# EAGLE design ESP32botV1 (EAGLE 7.7.0)
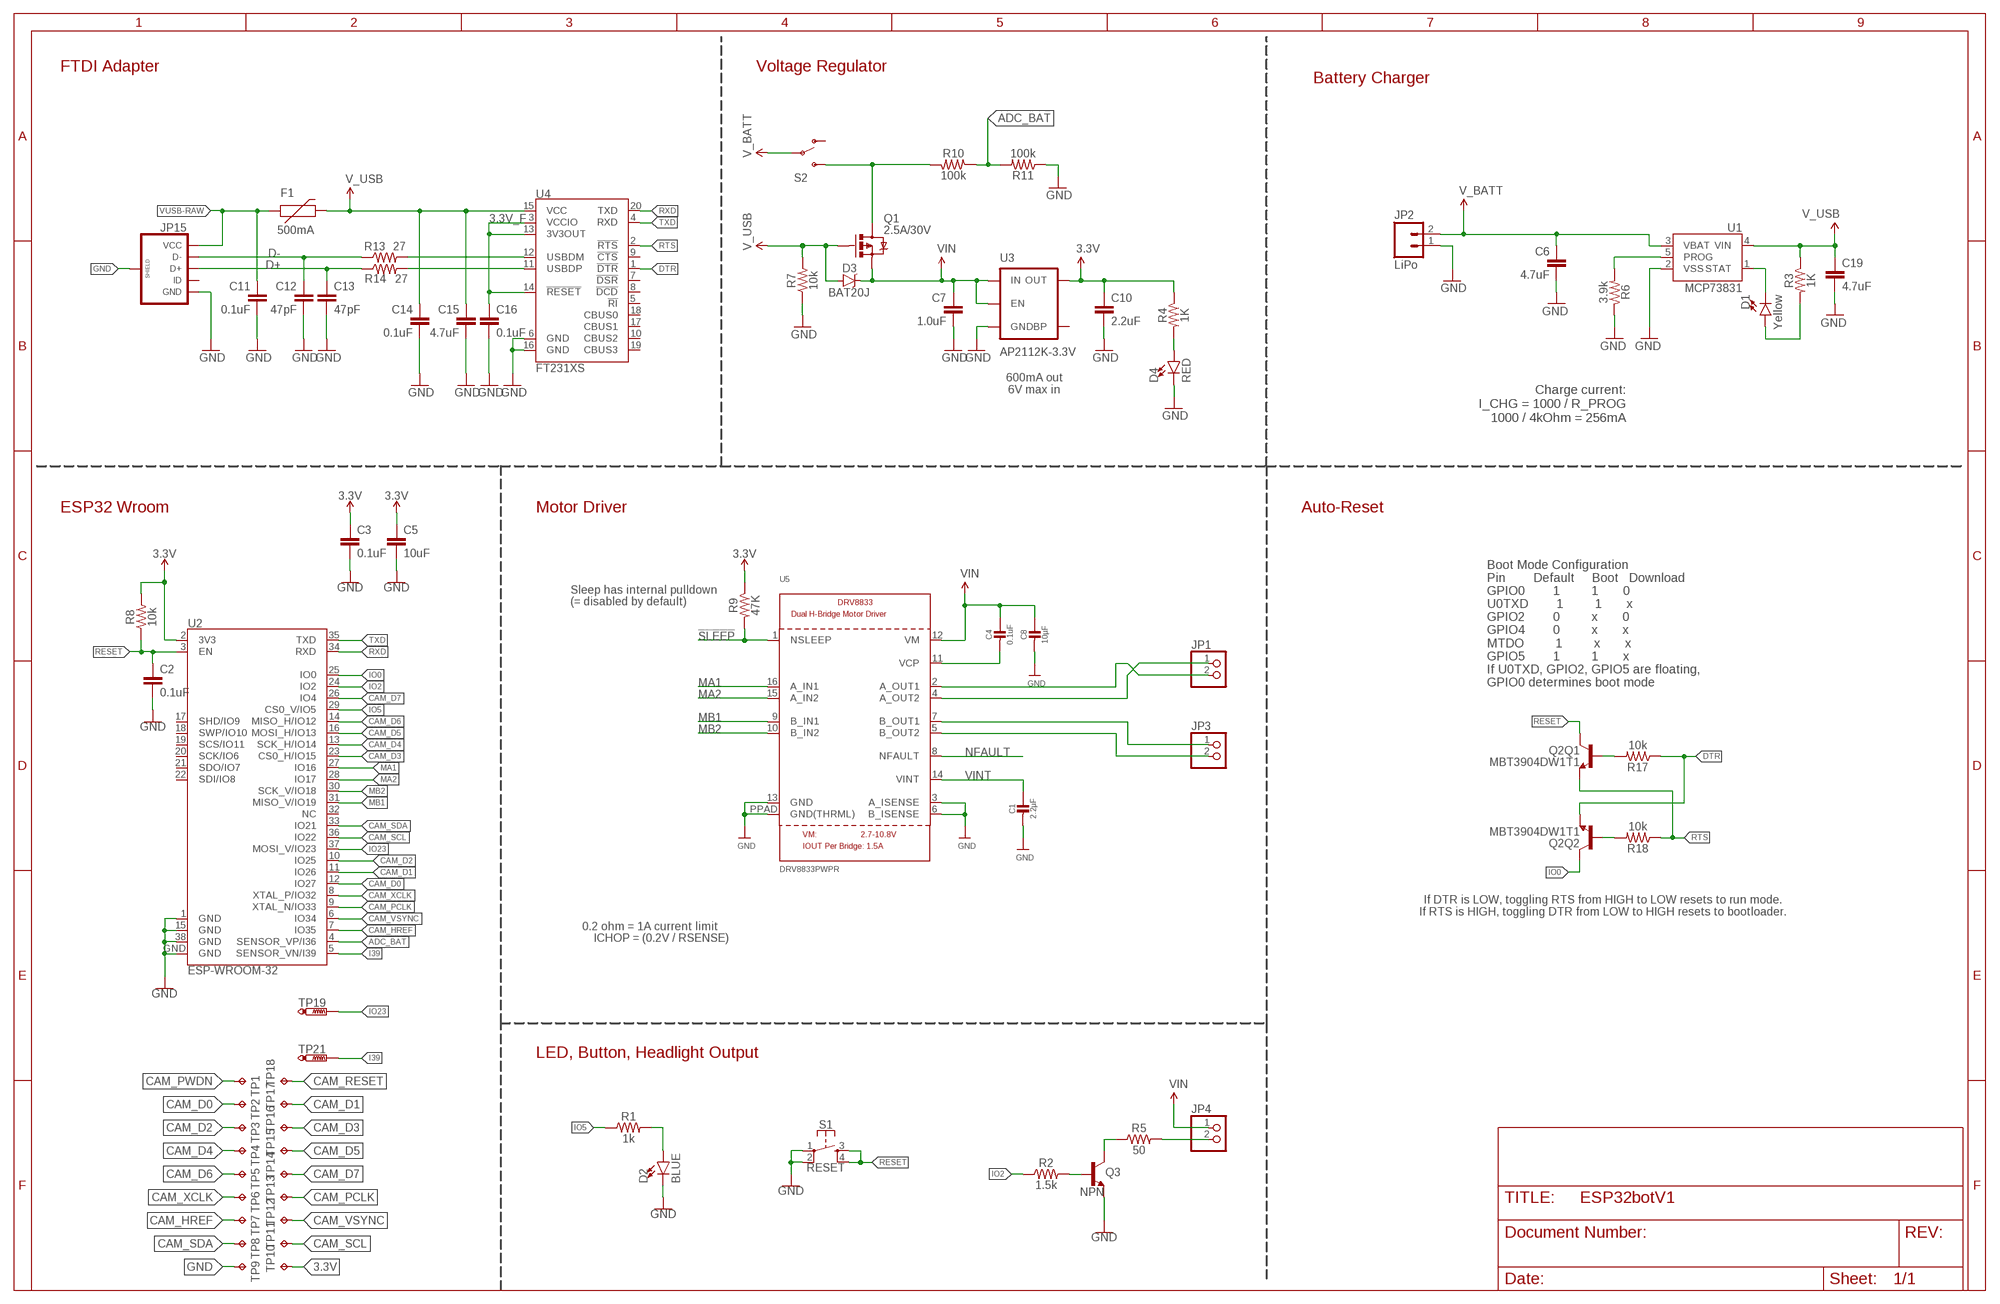
[diagram p0: schematic, sheet 1]

## Parts
C1  2.2µF  CAP_CERAMIC0805-NOOUTLINE  [0805-NO]
C2  0.1uF  0.1UF-0603-25V-(+80/-20%)  [0603]
C3  0.1uF  0.1UF-0603-25V-(+80/-20%)  [0603]
C4  0.1uF  CAP_CERAMIC0805-NOOUTLINE  [0805-NO]
C5  10uF  10UF-0603-6.3V-20%  [0603]
C6  4.7uF  4.7UF0603  [0603]
C7  1.0uF  1.0UF-0805-25V-(+80/-20%)  [0805]
C8  10µF  CAP_CERAMIC0805-NOOUTLINE  [0805-NO]
C10  2.2uF  2.2UF-0603-10V-20%  [0603]
C11  0.1uF  0.1UF-0603-25V-(+80/-20%)  [0603]
C12  47pF  47PF-0603-50V-5%  [0603]
C13  47pF  47PF-0603-50V-5%  [0603]
C14  0.1uF  0.1UF-0603-25V-(+80/-20%)  [0603]
C15  4.7uF  4.7UF-6.3V-10%(0603)0603  [0603-CAP]
C16  0.1uF  0.1UF-0603-25V-(+80/-20%)  [0603]
C19  4.7uF  4.7UF0603  [0603]
D1  Yellow  LED-YELLOW0603  [LED-0603@1]
D2  BLUE  LED-BLUE0603  [LED-0603@2]
D3  BAT20J  DIODE-SCHOTTKY-BAT20J  [SOD-323]
D4  RED  LED-RED0603  [LED-0603]
F1  500mA  PTCSMD  [PTC-1206]
JP1  HEADER-1X2ROUND  [1X02_ROUND]
JP2  LiPo  M02JST-PTH-2  [JST-2-PTH]
JP3  HEADER-1X2ROUND  [1X02_ROUND]
JP4  HEADER-1X2ROUND  [1X02_ROUND]
JP15  USB_MICROB_PLUGCONN-11752  [USB-B-MICRO-SMD_V03]
Q1  2.5A/30V  MOSFET-PCHANNELDMG2307L  [SOT23-3]
Q2  MBT3904DW1T1  [SC70-6]
Q3  NPN  TRANSISTOR_NPNMMBT2222A  [SOT23-3]
R1  1k  1KOHM-0603-1/10W-1%  [0603]
R2  1.5k  1KOHM-0603-1/10W-1%  [0603]
R3  1K  1KOHM-1/10W-1%(0603)  [0603]
R4  1K  1KOHM-1/10W-1%(0603)  [0603]
R5  50  1KOHM-0603-1/10W-1%  [0603]
R6  3.9k  2.0KOHM1/10W5%(0603)  [0603]
R7  10k  10KOHM-0603-1/10W-1%  [0603]
R8  10k  10KOHM-0603-1/10W-1%  [0603]
R9  47K  1KOHM-1/10W-1%(0603)  [0603]
R10  100k  10KOHM-0603-1/10W-1%  [0603]
R11  100k  10KOHM-0603-1/10W-1%  [0603]
R13  27  27OHM1/10W1%(0603)0603-RES  [0603]
R14  27  27OHM1/10W1%(0603)0603-RES  [0603]
R17  10k  10KOHM-0603-1/10W-1%  [0603]
R18  10k  10KOHM-0603-1/10W-1%  [0603]
S1  RESET  MOMENTARY-SWITCH-SPST-2-SMD-4.6X2.8MM  [TACTILE_SWITCH_SMD_4.6X2.8MM]
S2  SWITCH-SPDT-SMD-A  [SWITCH-SPST-SMD-A]
TP1  TPEC  [EDGECONNECTOR]
TP2  TPEC  [EDGECONNECTOR]
TP3  TPEC  [EDGECONNECTOR]
TP4  TPEC  [EDGECONNECTOR]
TP5  TPEC  [EDGECONNECTOR]
TP6  TPEC  [EDGECONNECTOR]
TP7  TPEC  [EDGECONNECTOR]
TP8  TPEC  [EDGECONNECTOR]
TP9  TPEC  [EDGECONNECTOR]
TP10  TPEC  [EDGECONNECTOR]
TP11  TPEC  [EDGECONNECTOR]
TP12  TPEC  [EDGECONNECTOR]
TP13  TPEC  [EDGECONNECTOR]
TP14  TPEC  [EDGECONNECTOR]
TP15  TPEC  [EDGECONNECTOR]
TP16  TPEC  [EDGECONNECTOR]
TP17  TPEC  [EDGECONNECTOR]
TP18  TPEC  [EDGECONNECTOR]
TP19  PTR1TP13R  [TP13R]
TP21  PTR1TP13R  [TP13R]
U1  MCP73831  [SOT23-5]
U2  ESP-WROOM-32  [ESP-WROOM-32]
U3  AP2112K-3.3V  V_REG_LDOSMD  [SOT23-5]
U4  FT231XS  [SSOP20_L]
U5  DRV8833PWPR  DRV8833  [HTSSOP16]

## Nets
3.3V: C3.1 C5.1 C10.1 R4.1 R8.2 R9.1 TP10.TP U2.2(3V3) U3.5(OUT)
3.3V_F: C16.1 U4.3(VCCIO) U4.13(3V3OUT) U4.14(!RESET)
!SLEEP: R9.2 U5.1(NSLEEP)
ADC_BAT: R10.1 R11.2 U2.4(SENSOR_VP/I36)
AOUT1: JP1.2 U5.2(A_OUT1)
AOUT2: JP1.1 U5.4(A_OUT2)
BOUT1: JP3.1 U5.7(B_OUT1)
BOUT2: JP3.2 U5.5(B_OUT2)
CAM_D0: TP2.TP U2.12(IO27)
CAM_D1: TP17.TP U2.11(IO26)
CAM_D2: TP3.TP U2.10(IO25)
CAM_D3: TP16.TP U2.23(CS0_H/IO15)
CAM_D4: TP4.TP U2.13(SCK_H/IO14)
CAM_D5: TP15.TP U2.16(MOSI_H/IO13)
CAM_D6: TP5.TP U2.14(MISO_H/IO12)
CAM_D7: TP14.TP U2.26(IO4)
CAM_HREF: TP7.TP U2.7(IO35)
CAM_PCLK: TP13.TP U2.9(XTAL_N/IO33)
CAM_PWDN: TP1.TP
CAM_RESET: TP18.TP
CAM_SCL: TP11.TP U2.36(IO22)
CAM_SDA: TP8.TP U2.33(IO21)
CAM_VSYNC: TP12.TP U2.6(IO34)
CAM_XCLK: TP6.TP U2.8(XTAL_P/IO32)
D+: C13.1 JP15.D+ R14.1
D-: C12.1 JP15.D- R13.1
DTR: Q2.1(Q2:E) R17.1 U4.1(!DTR)
GND: C1.2 C2.2 C3.2 C5.2 C6.2 C7.2 C8.2 C10.2 C11.2 C12.2 C13.2 C14.2 C15.2 C16.2 C19.2 D2.C D4.C JP2.1 JP15.GND JP15.SHIELD1(SHIELD) JP15.SHIELD2(SHIELD) JP15.SHIELD3(SHIELD) Q3.2(E) R6.1 R7.1 R11.1 S1.1 S1.2 TP9.TP U1.2(VSS) U2.1(GND) U2.15(GND) U2.38(GND) U2.GND U3.2(GND) U4.6(GND) U4.16(GND) U5.3(A_ISENSE) U5.6(B_ISENSE) U5.13(GND) U5.PPAD(GND(THRML))
I39: TP21.TP U2.5(SENSOR_VN/I39)
IO0: Q2.6(Q2:C) U2.25(IO0)
IO2: R2.1 U2.24(IO2)
IO5: R1.1 U2.29(CS0_V/IO5)
IO23: TP19.TP U2.37(MOSI_V/IO23)
MA1: U2.27(IO16) U5.16(A_IN1)
MA2: U2.28(IO17) U5.15(A_IN2)
MB1: U2.31(MISO_V/IO19) U5.9(B_IN1)
MB2: U2.30(SCK_V/IO18) U5.10(B_IN2)
N$1: D4.A R4.2
N$2: D2.A R1.2
N$3: JP4.2 R5.2
N$4: Q1.3(D) R10.2 S2.3(S)
N$7: R13.2 U4.12(USBDM)
N$8: R14.2 U4.11(USBDP)
N$9: D1.C U1.1(STAT)
N$10: Q2.5(Q1:B) R17.2
N$12: Q2.2(Q2:B) R18.2
N$16: R6.2 U1.5(PROG)
N$17: D1.A R3.2
N$26: C4.2 U5.11(VCP)
NFAULT: U5.8(NFAULT)
OUT1: Q3.3(C) R5.1
OUT1N: Q3.1(B) R2.2
RESET: C2.1 Q2.3(Q1:C) R8.1 S1.3 S1.4 U2.3(EN)
RTS: Q2.4(Q1:E) R18.1 U4.2(!RTS)
RXD: U2.34(RXD) U4.20(TXD)
TXD: U2.35(TXD) U4.4(RXD)
V_BATT: C6.1 JP2.2 S2.2(P) U1.3(VBAT)
V_USB: C14.1 C15.1 C19.1 D3.A F1.2 Q1.1(G) R3.1 R7.2 U1.4(VIN) U4.15(VCC)
VIN: C4.1 C7.1 C8.1 D3.C JP4.1 Q1.2(S) U3.1(IN) U3.3(EN) U5.12(VM)
VINT: C1.1 U5.14(VINT)
VUSB-RAW: C11.1 F1.1 JP15.VBUS(VCC)
Unconnected: JP15.ID S2.1(O) U2.17(SHD/IO9) U2.18(SWP/IO10) U2.19(SCS/IO11) U2.20(SCK/IO6) U2.21(SDO/IO7) U2.22(SDI/IO8) U2.32(NC) U3.4(BP) U4.5(!RI) U4.7(!DSR) U4.8(!DCD) U4.9(!CTS) U4.10(CBUS2) U4.17(CBUS1) U4.18(CBUS0) U4.19(CBUS3)

## Notes on the sheet
- FTDI Adapter | Voltage Regulator
- Battery Charger
- 600mA out
  6V max in
- Charge current:
  I_CHG = 1000 / R_PROG
  1000 / 4kOhm = 256mA
- ESP32 Wroom | Motor Driver | Auto-Reset
- Sleep has internal pulldown
- (= disabled by default)
- Boot Mode Configuration
  Pin        Default     Boot   Download
  GPIO0        1         1       0
  U0TXD        1         1       x
  GPIO2        0         x       0
  GPIO4        0         x       x
  MTDO         1         x       x
  GPIO5        1         1       x
  If U0TXD, GPIO2, GPIO5 are floating, 
  GPIO0 determines boot mode
- If DTR is LOW, toggling RTS from HIGH to LOW resets to run mode.
  If RTS is HIGH, toggling DTR from LOW to HIGH resets to bootloader.
- 0.2 ohm = 1A current limit
- ICHOP = (0.2V / RSENSE)
- LED, Button, Headlight Output

## Library data of the parts
C1 C4 C8 = microbuilder:CAP_CERAMIC: Ceramic Capacitors For new designs, use the packages preceded by an '_' character since they are more reliable: The following footprints should be used on most boards: _0402 - Standard footprint for regular board layouts _0603 - Standard footprint for regular board layouts _0805 - Standard footprint for regular board layouts _1206 - Standard footprint for regular board layouts For extremely tight-pitch boards where space is at a premium, the following 'micro-pitch' footprints can be used (smaller pads, no silkscreen outline, etc.): _0402MP - Micro-pitch footprint for very dense/compact boards _0603MP - Micro-pitch footprint for very dense/compact boards _0805MP - Micro-pitch footprint for very dense/compact boards _1206MP - Micro-pitch footprint for very dense/compact boards
C2 C3 C11 C14 C16 = SparkFun-Capacitors:0.1UF: 0.1µF ceramic capacitors A capacitor is a passive two-terminal electrical component used to store electrical energy temporarily in an electric field.; PROD_ID: CAP-00810
C5 = SparkFun-Capacitors:10UF: 10.0µF ceramic capacitors A capacitor is a passive two-terminal electrical component used to store electrical energy temporarily in an electric field.; PROD_ID: CAP-11015
C6 C19 = SparkFun-Capacitors:4.7UF: 4.7µF ceramic capacitors A capacitor is a passive two-terminal electrical component used to store electrical energy temporarily in an electric field.; PROD_ID: CAP-08280
C7 = SparkFun-Capacitors:1.0UF: 1µF ceramic capacitors A capacitor is a passive two-terminal electrical component used to store electrical energy temporarily in an electric field.; PROD_ID: CAP-11625
C10 = SparkFun-Capacitors:2.2UF: 2.2µF ceramic capacitors A capacitor is a passive two-terminal electrical component used to store electrical energy temporarily in an electric field.; PROD_ID: CAP-07888
C12 C13 = SparkFun-Capacitors:47PF: 47pF ceramic capacitors A capacitor is a passive two-terminal electrical component used to store electrical energy temporarily in an electric field.; PROD_ID: CAP-08913
C15 = SparkFun-Capacitors:4.7UF-6.3V-10%(0603): CAP-08280; PROD_ID: CAP-08280
D1 = SparkFun-LED:LED-YELLOW: Yellow SMD LEDs LilyPad 1206- DIO-09909 0603- DIO-09003 "SMART" means more efficient and expensive; PROD_ID: DIO-09003
D2 = SparkFun-LED:LED-BLUE: Blue SMD LED Used in manufacturing of various products at SparkFun Packages: 0603 - SMD 0603 package [Product Link] <http://www.digikey.com/product-detail/en/SMLE12BC7TT86/511-1589-2-ND/1641808> 1206 - SMD1206 package [Product Link] <http://www.digikey.com/product-detail/en/lite-on-inc/LTST-C150TBKT/160-1643-1-ND/573584> SparkFun Products: ESP8266 Thing-Dev Board <https://www.sparkfun.com/products/13711> RedBoard <https://www.sparkfun.com/products/12757>; PROD_ID: DIO-08575
D3 = SparkFun-DiscreteSemi:DIODE-SCHOTTKY: Schottky diodes in SFE's production catalog BAT20J 1A 23V 0.62Vf RB751 120mA 40V 0.37Vf PMEG4005EJ 0.5A 40V 0.42Vf MBRA140 1A 40V 0.5Vf B340A 3A 40V SMA; PROD_ID: DIO-11623
D4 = SparkFun-LED:LED-RED: Red SMD LED Used in manufacturing of most products at SparkFun 0603 - SMD 0603 package Forward Voltage: 1.9V Forward Current: 20mA Datasheet: [Product Link] <http://docs.avagotech.com/docs/AV02-0551EN> 0603 SMART - SMD 0603 SMART package ( more efficient and expensive) Forward Voltage: 1.8V Forward Current: 20mA Datasheet: [Product Link] <http://www.osram-os.com/Graphics/XPic2/00077099_0.pdf> 1206 - SMD 1206 package Forward Voltage: 2V Forward Current: 20mA Datasheet: [Product Link] <https://www.sparkfun.com/datasheets/DevTools/LilyPad/Q150OVS4.pdff> 1206 LilyPad - SMD 1206 LilyPad package Forward Voltage: 2V Forward Current: 20mA Datasheet: [Product Link] <https://www.sparkfun.com/datasheets/DevTools/LilyPad/Q150OVS4.pdf>; PROD_ID: DIO-00819
F1 = SparkFun-PowerIC:PTC: Resettable Fuse PTC Resettable Fuse. Spark Fun Electronics SKU : COM-08357; PROD_ID: RES-11150
JP1 JP3 JP4 = microbuilder:HEADER-1X2: PIN HEADER
JP2 = SparkFun-Connectors:M02: Standard 2-pin 0.1" header. Use with - straight break away headers ( PRT-00116) - right angle break away headers (PRT-00553) - swiss pins (PRT-00743) - machine pins (PRT-00117) - female headers (PRT-00115) Molex polarized connector foot print use with: PRT-08233 with associated crimp pins and housings. 2.54_SCREWTERM for use with PRT-10571. 3.5mm Screw Terminal footprints for PRT-08084 5mm Screw Terminal footprints for use with PRT-08432; PROD_ID: CONN-09863; SKU: PRT-09914
JP15 = SparkFun-Connectors:USB_MICROB_PLUG: USB Micro-B connectors Some male, some female. Watch your step!; PROD_ID: CONN-11752
Q1 = SparkFun-DiscreteSemi:MOSFET-PCHANNEL: Generic PMOSFET IRLML2244 - TRANS-11153 (SOT-23 -20V -4.3A) (1.Gate 2.Source 3.Drain) FQP27P06 - COM-10349 <http://www.sparkfun.com/products/10349> (TO-220 -60V -27A) (1.Gate 2.Source 3.Drain); PROD_ID: TRANS-11308
Q2 = esp32-thing-temp:MBT3904DW1T1: MBT3904DW1 Dual NPN Transistors The MBT3904W1 puts two general purpose 3904 NPN transistors in a single package. Datasheet <http://www.onsemi.com/pub_link/Collateral/MBT3904DW1T1-D.PDF>; PROD_ID: TRANS-13337
Q3 = SparkFun-DiscreteSemi:TRANSISTOR_NPN: Generic NPN BJT MMBT2222A - TRANS-08049 (SOT-23, 1A 40V) MPSA42 - TRANS-09116 (SOT-23, 500mA 300V) MMBT5088LT1G - TRANS-11160 (SOT-23, 50 mA 30V) BC547 - COM-08928 <http://www.sparkfun.com/products/8928> (TO-92 45V 100mA) (1.Collector 2.Base 3.Emitter) 2N3904 - COM-00521 <http://www.sparkfun.com/products/521> (TO-92 40V 200mA) (1.Emitter 2.Base 3.Collector) P2N2222A - COM-12852 <http://www.sparkfun.com/products/12852> (TO-92 40V 600mA) (1.Collector 2.Base 3.Emitter); PROD_ID: TRANS-08049; VALUE: MMBT2222A
R1 = SparkFun-Resistors:1KOHM: 1kΩ resistor A resistor is a passive two-terminal electrical component that implements electrical resistance as a circuit element. Resistors act to reduce current flow, and, at the same time, act to lower voltage levels within circuits. - Wikipedia; PROD_ID: RES-07856
R2 R5 = SparkFun-Resistors:1KOHM: 1kΩ resistor A resistor is a passive two-terminal electrical component that implements electrical resistance as a circuit element. Resistors act to reduce current flow, and, at the same time, act to lower voltage levels within circuits. - Wikipedia; PROD_ID: RES-07856; VALUE: 1k
R3 R4 = SparkFun-Resistors:1KOHM-1/10W-1%(0603): RES-07856; PROD_ID: RES-07856
R6 = SparkFun-Resistors:2.0KOHM1/10W5%(0603): RES-08296; PROD_ID: RES-08296; VALUE: 2.0k
R7 R8 R17 R18 = SparkFun-Resistors:10KOHM: 10kΩ resistor A resistor is a passive two-terminal electrical component that implements electrical resistance as a circuit element. Resistors act to reduce current flow, and, at the same time, act to lower voltage levels within circuits. - Wikipedia; PROD_ID: RES-00824
R9 = SparkFun-Resistors:1KOHM-1/10W-1%(0603): RES-07856; PROD_ID: RES-07856; VALUE: 1K
R10 R11 = SparkFun-Resistors:10KOHM: 10kΩ resistor A resistor is a passive two-terminal electrical component that implements electrical resistance as a circuit element. Resistors act to reduce current flow, and, at the same time, act to lower voltage levels within circuits. - Wikipedia; PROD_ID: RES-00824; VALUE: 10k
R13 R14 = SparkFun-Resistors:27OHM1/10W1%(0603): RES-09334; PROD_ID: RES-09334
S1 = SparkFun-Switches:MOMENTARY-SWITCH-SPST-2: Momentary Switch (Pushbutton) - SPST - Two Circuits Normally-open (NO) SPST momentary switches (buttons, pushbuttons). Schematic symbol includes two switch circuits. Variants SMD-4.6MMX2.8MM - 4.60mm x 2.80mm Tactile Momentary Button Switch - Used on SparkFun SAMD21 Mini Breakout <https://www.sparkfun.com/products/13664> SMD-5.2MM - Mini Pushbutton Switch - SMD <https://www.sparkfun.com/products/8720> - Used on Arduino Pro Mini <https://www.sparkfun.com/products/11114>; PROD_ID: SWCH-13065
S2 = SparkFun-Electromechanical:SWITCH-SPDT: SPDT Switch Simple slide switch, Spark Fun Electronics SKU : COM-00102 DPDT SMT slide switch, AYZ0202, SWCH-08179; PROD_ID: SWCH-10651
TP1-TP18 = testpad:TP: Test pad
TP19 TP21 = testpad:PTR1: TEST PIN
U1 = SparkFun-PowerIC:MCP73831: Miniature single cell, fully integrated Li-Ion, Li-polymer charge management controller http://ww1.microchip.com/downloads/en/DeviceDoc/20001984g.pdf IC-09995; PROD_ID: IC-09995
U2 = SparkFun-RF:ESP-WROOM-32; PROD_ID: IC-13849
U3 = SparkFun-PowerIC:V_REG_LDO: Voltage Regulator LDO Standard 150mA LDO voltage regulator in SOT-23 layout. Micrel part MIC5205. BP (by-pass) pin is used to lower output noise with 470pF cap.; PROD_ID: VREG-12457
U4 = SparkFun-DigitalIC:FT231X: FTDI FT231X Full Speed USB to Full-handshake UART This USB2.0 Full Speed IC offers a compact bridge to full handshake UART interfaces. The device is a UART, capable of operating up to 3MBaud, with low power consumption (8mA). The FT231X includes the complete FT-X series feature set and enables USB to be added into a system design quickly and easily over a UART interface.; PROD_ID: IC-11524
U5 = microbuilder:DRV8833: DRV8833 Dual H-Bridge Motor Driver -- HTSSOP Package

## Board
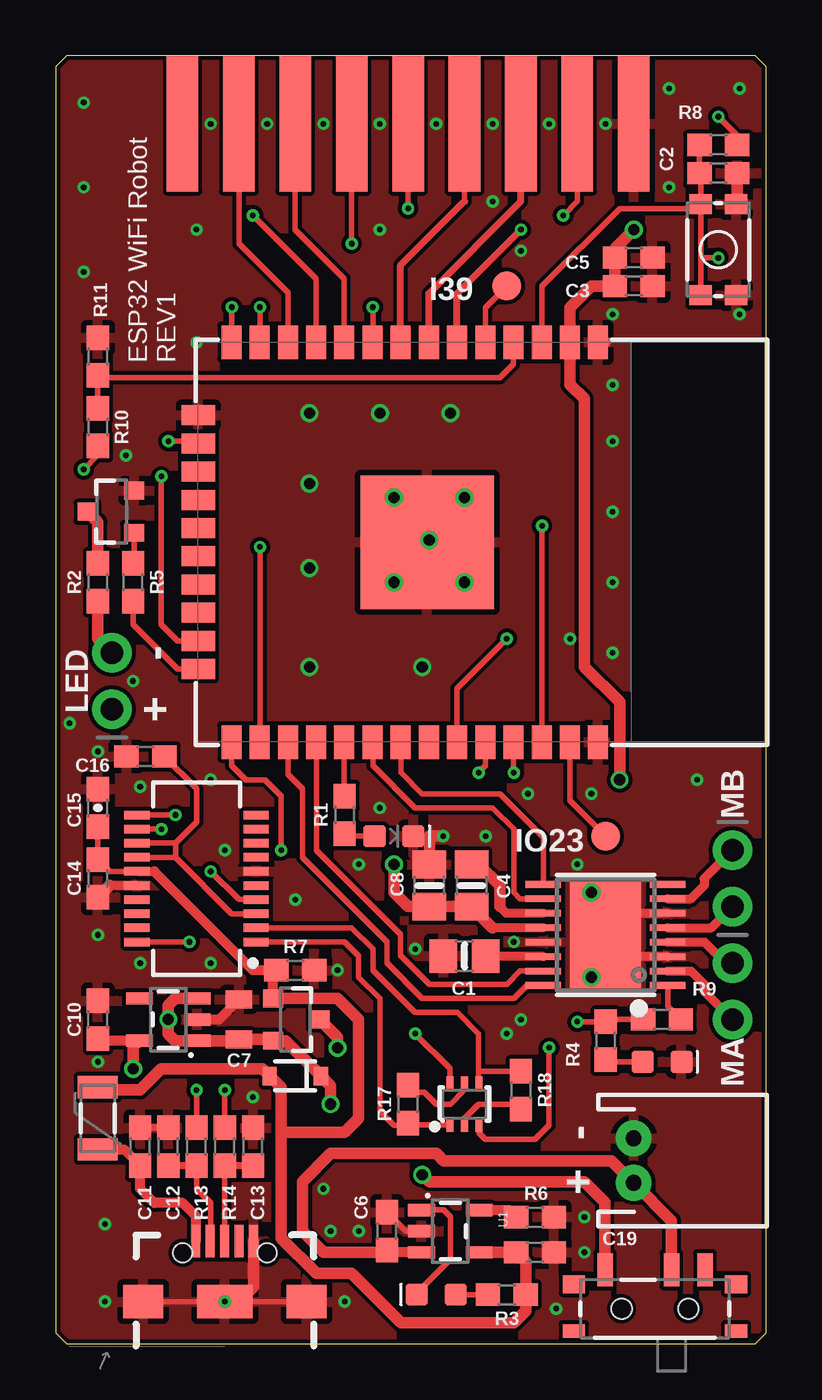
[diagram p1: board, top side]
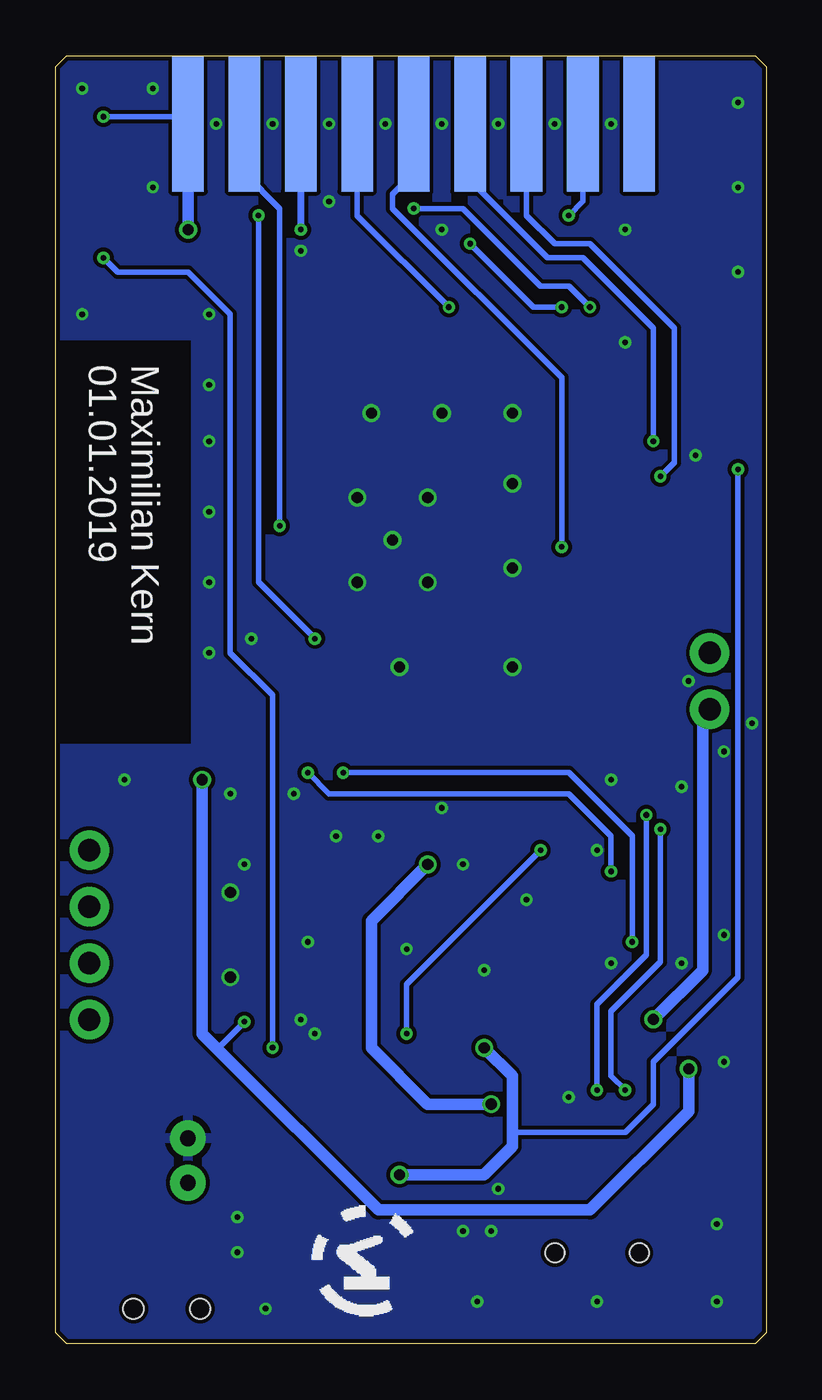
[diagram p2: board, bottom side, seen from below]

Size 32 x 58 mm. Coordinates in mm from the lower left corner, seen from the top.
Outline: 0.5,0 31.5,0 32,0.5 32,57.5 31.5,58 0.5,58 0,57.5 0,0.5 0.5,0
Copper layers (1*16): Top 0.035mm / dielectric 1.5mm / Bottom 0.035mm
Design rules "aisler_2_layer *": minimum track width 0.1mm, minimum drill 0.2mm, track to track 0.1mm, track to pad 0.1mm, pad to pad 0.1mm, via to via 0.1mm, smd to smd 0.1mm, copper to edge 0.2mm, drill to drill 0.21mm, minimum pad ring 0.25mm, minimum via ring 0.15mm, stop-mask expansion 0mil, vias tented up to drill 50mil, thermal gap 10mil

### Footprints (pad centres in the part's own frame; a part is rotated, then mirrored left to right if it is on the bottom)
0805-NO = smd 1.24 x 1.5: 1 -0.95,0; 2 0.95,0
0603 = smd 1.1 x 1: 1 -0.85,0; 2 0.85,0
0805 = smd 0.8 x 1.2: 1 -0.9,0; 2 0.9,0
0603-CAP = smd 1.1 x 1: 1 -0.85,0; 2 0.85,0
LED-0603@1 = smd 1 x 1: A 0,-0.877; C 0,0.877
LED-0603@2 = smd 1 x 1: A -0.877,0; C 0.877,0
SOD-323 = smd 0.63 x 0.83: A 1.15,0; C -1.15,0
LED-0603 = smd 1 x 1: A 0,-0.877; C 0,0.877
PTC-1206 = smd 1 x 1.8: 1 -1.4,0; 2 1.4,0
1X02_ROUND = drill 1 pad 1.778: 1 -1.27,0; 2 1.27,0
JST-2-PTH = drill 0.7 pad 1.6: 1 -1,0; 2 1,0
USB-B-MICRO-SMD_V03 = smd 1.45 x 0.4: D+ 2.725,0; D- 2.725,0.65; GND 2.725,-1.3; ID 2.725,-0.65; VBUS 2.725,1.3 | smd 1.5 x 1.8: SHIELD1 0,3.685; SHIELD2 0,-3.685 | smd 1.5 x 2.5: SHIELD3 0,0 | hole 0.85: 2.2,1.9; 2.2,-1.9
SOT23-3 = smd 0.8 x 0.9: 1 -0.95,-1; 2 0.95,-1; 3 0,1.1
SC70-6 = smd 0.3 x 0.66: 1 -0.65,-0.92; 2 0,-0.92; 3 0.65,-0.92; 4 0.65,0.92; 5 0,0.92; 6 -0.65,0.92
TACTILE_SWITCH_SMD_4.6X2.8MM = smd 0.9 x 1: 1 -2.05,-0.8; 2 2.05,-0.8; 3 2.05,0.8; 4 -2.05,0.8
SWITCH-SPST-SMD-A = smd 0.7 x 1.5: 1 -2.25,-1.75; 2 -0.75,-1.75; 3 2.25,-1.75 | smd 1 x 0.6: GND1 -3.65,1; GND3 3.65,1 | smd 1 x 0.8: GND2 -3.65,-1.1; GND4 3.65,-1.1 | hole 0.9: -1.5,0; 1.5,0
EDGECONNECTOR = smd 1.422 x 6.096: TP 0,0
TP13R = smd 1.3 x 1.3: TP 0,0
SOT23-5 = smd 0.55 x 1.2: 1 -0.95,-1.3; 2 0,-1.3; 3 0.95,-1.3; 4 0.95,1.3; 5 -0.95,1.3
ESP-WROOM-32 = smd 0.9 x 1.5: 1 7.7,9; 2 6.43,9; 3 5.16,9; 4 3.89,9; 5 2.62,9; 6 1.35,9; 7 0.08,9; 8 -1.19,9; 9 -2.46,9; 10 -3.73,9; 11 -5,9; 12 -6.27,9; 13 -7.54,9; 14 -8.81,9; 25 -8.81,-9; 26 -7.54,-9; 27 -6.27,-9; 28 -5,-9; 29 -3.73,-9; 30 -2.46,-9; 31 -1.19,-9; 32 0.08,-9; 33 1.35,-9; 34 2.62,-9; 35 3.89,-9; 36 5.16,-9; 37 6.43,-9; 38 7.7,-9 | smd 1.5 x 0.9: 15 -10.3,5.715; 16 -10.3,4.445; 17 -10.3,3.175; 18 -10.3,1.905; 19 -10.3,0.635; 20 -10.3,-0.635; 21 -10.3,-1.905; 22 -10.3,-3.175; 23 -10.3,-4.445; 24 -10.3,-5.715 | smd 6 x 6: GND 0,0
SSOP20_L = smd 0.381 x 1.143: 1 -2.857,-2.68; 2 -2.223,-2.68; 3 -1.587,-2.68; 4 -0.953,-2.68; 5 -0.318,-2.68; 6 0.318,-2.68; 7 0.953,-2.68; 8 1.587,-2.68; 9 2.223,-2.68; 10 2.857,-2.68; 11 2.857,2.68; 12 2.223,2.68; 13 1.587,2.68; 14 0.953,2.68; 15 0.318,2.68; 16 -0.318,2.68; 17 -0.953,2.68; 18 -1.587,2.68; 19 -2.223,2.68; 20 -2.857,2.68
HTSSOP16 = smd 0.3 x 1.6: 1 -2.275,-2.8; 2 -1.625,-2.8; 3 -0.975,-2.8; 4 -0.325,-2.8; 5 0.325,-2.8; 6 0.975,-2.8; 7 1.625,-2.8; 8 2.275,-2.8; 9 2.275,2.8; 10 1.625,2.8; 11 0.975,2.8; 12 0.325,2.8; 13 -0.325,2.8; 14 -0.975,2.8; 15 -1.625,2.8; 16 -2.275,2.8 | smd 4.8 x 3.2: PPAD 0,0

### Placement (x,y rotation side)
C1  18.41,17.46 180 top
C2  29.84,52.7 0 top
C3  26.04,47.62 0 top
C4  18.73,20.64 90 top
C5  26.04,48.9 0 top
C6  14.92,5.08 90 top
C7  8.26,14.61 90 top
C8  16.83,20.64 90 top
C10  1.91,14.61 90 top
C11  3.81,8.89 90 top
C12  5.08,8.89 90 top
C13  8.89,8.89 90 top
C14  1.91,20.95 270 top
C15  1.91,24.13 90 top
C16  4.05,26.45 180 top
C19  21.59,4.13 0 top
D1  17.14,2.22 90 top
D2  15.24,22.86 0 top
D3  10.79,12.06 180 top
D4  27.3,12.7 270 top
F1  1.91,10.16 90 top
JP1  30.48,15.88 270 top
JP2  26.04,8.26 270 top
JP3  30.48,20.95 270 top
JP4  2.54,29.84 90 top
JP15  7.62,1.91 90 top
Q1  10.79,14.61 270 top
Q2  18.41,10.79 0 top
Q3  2.54,37.47 90 top
R1  13.02,23.81 270 top
R2  3.49,34.29 90 top
R3  20.32,2.22 180 top
R4  24.77,13.65 270 top
R5  1.91,34.29 270 top
R6  21.59,5.71 180 top
R7  10.79,16.83 180 top
R8  29.84,53.98 0 top
R9  27.3,14.61 0 top
R10  1.91,41.27 270 top
R11  1.91,44.45 270 top
R13  6.35,8.89 90 top
R14  7.62,8.89 90 top
R17  15.88,10.79 90 top
R18  20.95,11.43 270 top
S1  29.84,49.26 90 top
S2  26.99,1.59 180 top
TP1  5.71,54.93 0 top
TP2  8.26,54.93 0 top
TP3  10.79,54.93 0 top
TP4  13.34,54.93 0 top
TP5  15.88,54.93 0 top
TP6  18.41,54.93 0 top
TP7  20.95,54.93 0 top
TP8  23.5,54.93 0 top
TP9  26.04,54.93 0 top
TP10  26.04,54.93 0 bottom
TP11  23.5,54.93 0 bottom
TP12  20.95,54.93 0 bottom
TP13  18.41,54.93 0 bottom
TP14  15.88,54.93 0 bottom
TP15  13.34,54.93 0 bottom
TP16  10.79,54.93 0 bottom
TP17  8.26,54.93 0 bottom
TP18  5.71,54.93 0 bottom
TP19  24.77,22.86 0 top
TP21  20.32,47.62 0 top
U1  17.78,5.08 270 top
U2  16.73,36.09 0 top
U3  5.08,14.61 90 top
U4  6.35,20.95 90 top
U5  24.77,18.41 90 top

### Tracks (layer width: path | path; a pad name or v marks a point on that pad's centre or on a via)
3.3V  (via drill 0.25, 0.5)
  Top 0.254: R9.1 24.87,14.61 R4.1 v23.5,14.5 | R8.2 30.7,54.4 v29.84,55.24
  Top 0.305: 2,13.65 C10.1
  Top 0.457: U3.5 2,13.65
  Top 0.508: v25.4,25.4 25.4,28.89 23.81,30.48 23.81,42.55 23.16,43.2 U2.2 23.16,46.66 24.13,47.62 C3.1 C5.1 25.18,49.31 v26.04,50.16 | v3.49,12.38 3.49,13.37 U3.5
  Bottom 0.254: 24.77,13.34 24.66,13.34 v23.5,14.5 | v29.84,55.24 26.35,55.24 TP10.TP
  Bottom 0.508: v3.49,12.38 3.49,10.48 7.94,6.03 17.46,6.03 24.77,13.34 25.4,13.97 v25.4,25.4 | v26.04,50.16 TP10.TP
3.3V_F
  Top 0.254: U4.14 5.4,21.91 | 5.4,21.91 7.94,19.37 U4.3 | U4.13 5.4,22.54 | 5.4,21.91 5.4,22.54 | 5.4,22.54 6.35,23.5 6.35,25 C16.1
!SLEEP
  Top 0.254: R9.2 27.57,15.2 U5.1
ADC_BAT
  Top 0.254: R10.1 R11.2 2.01,43.5 20,43.5 20.62,44.12 U2.4
AOUT1
  Top 0.406: U5.2 28.61,16.79 29.21,16.19 29.21,15.88 JP1.2
AOUT2
  Top 0.406: U5.4 29.22,18.09 30.16,17.14
  Top 0.508: 30.16,17.14 JP1.1
BOUT1
  Top 0.406: U5.7 28.61,20.04 29.21,20.64 29.21,20.95 JP3.1
BOUT2
  Top 0.406: U5.5 29.54,18.74 30.16,19.37 30.16,19.68
  Top 0.508: 30.16,19.68 JP3.2
CAM_D0
  Top 0.254: U2.12 10.46,47.33 8.26,49.53 TP2.TP
CAM_D1  (via drill 0.25)
  Top 0.254: U2.11 11.73,47.96 v8.89,50.8
  Bottom 0.254: v8.89,50.8 8.26,51.44 TP17.TP
CAM_D2
  Top 0.254: TP3.TP 10.79,50.16 13,47.96 U2.10
CAM_D3  (via drill 0.25)
  Top 0.254: U2.23 5.5,31.65 4.76,32.38 v4.76,39.05
  Bottom 0.254: TP16.TP 10.79,50.8 9.53,49.53 7.94,49.53 4.13,45.72 4.13,39.69 v4.76,39.05
CAM_D4  (via drill 0.25)
  Top 0.254: v9.21,46.67 9.21,45.11 U2.13 | v13.34,49.53 TP4.TP
  Bottom 0.254: v9.21,46.67 10.48,46.67 v13.34,49.53
CAM_D5  (via drill 0.25)
  Top 0.254: U2.16 5.82,40.54 5.71,40.64 v5.08,40.64
  Bottom 0.254: v5.08,40.64 5.08,45.72 8.26,48.9 9.84,48.9 13.34,52.39 TP15.TP
CAM_D6  (via drill 0.25)
  Top 0.254: TP5.TP v15.88,51.12 | v7.94,46.67 7.94,45.11 U2.14
  Bottom 0.254: v7.94,46.67 8.89,47.62 10.16,47.62 13.65,51.12 v15.88,51.12
CAM_D7  (via drill 0.25)
  Top 0.254: v9.21,35.88 9.21,27.11 U2.26
  Bottom 0.254: TP14.TP 15.88,52.7 16.83,51.75 16.83,51.12 9.21,43.5 v9.21,35.88
CAM_HREF
  Top 0.305: U2.7 16.81,47.29 20.95,51.44 TP7.TP
CAM_PCLK  (via drill 0.25)
  Top 0.254: v14.29,46.67 14.29,45.11 U2.9
  Bottom 0.254: v14.29,46.67 18.41,50.8 TP13.TP
CAM_SCL  (via drill 0.25)
  Top 0.254: v21.91,36.83 21.91,27.11 U2.36
  Bottom 0.254: TP11.TP 23.5,52.7 21.91,51.12 v21.91,36.83
CAM_SDA  (via drill 0.25)
  Top 0.254: U2.33 18.08,29.51 v20.32,31.75 | TP8.TP 23.5,51.44 v22.86,50.8
  Bottom 0.254: v22.86,50.8 22.86,34.29 v20.32,31.75
CAM_VSYNC  (via drill 0.25)
  Top 0.305: U2.6 18.08,47.29 v20.95,50.16
  Bottom 0.305: v20.95,50.16 TP12.TP
CAM_XCLK
  Top 0.254: 18.41,51.44 TP6.TP
  Top 0.305: U2.8 15.54,48.56 18.41,51.44
D+
  Top 0.254: R14.1 JP15.D+
  Top 0.305: R14.1 C13.1
D-
  Top 0.254: R13.1 6.35,6.99 6.99,6.35 6.99,4.64 JP15.D-
  Top 0.305: C12.1 R13.1
DTR
  Top 0.254: Q2.1 15.95,9.88 | U4.1 13.02,18.1 13.65,17.46 13.65,16.51 14.61,15.56 14.61,10.48 15.24,9.84 15.77,9.84 15.77,9.73
  Top 0.508: 15.95,9.88 R17.1 15.77,9.84
GND  (via drill 0.25, 0.5)
  Top 0.254: U1.2 15.77,5.08 C6.2 | JP15.SHIELD1 JP15.SHIELD3 8.26,1.91 JP15.SHIELD2
  Top 0.305: C12.2 C11.2
  Top 0.406: U5.6 26.38,19.39 | U5.3 26.38,17.44 | U4.16 2.44,20.64
  Top 0.457: U3.2 7.36,14.61 C7.2
  Top 0.508: U2.1 24.75,45.09 | JP15.GND 8.92,2.57 8.26,1.91 | 2.44,20.64 C14.2 | C2.2 30.7,51.36 S1.2 | C8.2 16.83,22.86 v17.46,22.86
  other vias: 25.08,43.18 25.08,40.64 25.08,37.47 30.8,46.35 25.08,46.35 24.13,24.77 28.89,25.4 19.37,22.86 14.61,24.13 13.65,21.59 16.19,17.78 20.32,13.97 3.81,17.14 1.91,18.41 7.62,22.23 10.79,20 25.08,31.11 25.08,34.29 23.81,5.71 23.81,4.13 13.65,5.08 12.38,5.08 2.22,1.91 2.22,5.4 13.02,1.91 1.27,55.88 1.27,48.26 1.27,52.07 1.91,26.67 15.24,38.1 18.41,38.1 15.24,34.29 18.41,34.29 16.83,36.2 16.51,30.48 11.43,30.48 11.43,41.91 17.78,41.91 14.61,41.91 11.43,38.73 11.43,34.92 12.7,16.83 8.89,11.11 7.62,1.91 22.54,1.59 14.61,50.16 19.68,51.44 27.62,52.07 27.62,56.52 30.8,56.52 24.77,54.93 21.27,24.77 23.18,31.75 22.23,54.93 19.68,54.93 17.14,54.93 14.61,54.93 12.06,54.93 9.53,54.93 6.99,54.93 3.17,40.01 20.64,18.1 6.35,45.09 6.35,50.16 6.99,17.14 3.81,25.08 3.49,29.84 0.64,27.94 23.5,21.59 20.95,14.61 6.99,25.4 1.91,12.7 12.06,6.99 20.95,49.21 24.13,20.32 24.13,16.51
  pour Top (isolate 0.178): 0,0 0,58.09 32,58.09 32,45.41 25.68,45.41 25.68,26.78 32,26.78 32,0
  pour Bottom (isolate 0.178): 0,0 0,58.09 32,58.09 32,45.41 25.68,45.41 25.68,26.78 32,26.78 32,0
I39
  Top 0.254: U2.5 19.35,46.66 TP21.TP
IO0  (via drill 0.25)
  Top 0.254: v10.16,22.23 10.16,24.67 9.43,25.4 8.57,25.4 7.94,26.04 7.94,27.08 U2.25 | Q2.6 17.77,12.4 v16.19,13.97
  Bottom 0.254: v10.16,22.23 16.19,16.19 v16.19,13.97
IO2
  Top 0.254: U2.24 5.5,30.38 3.49,32.38 R2.1
IO5
  Top 0.254: U2.29 13,24.68 R1.1
IO23
  Top 0.254: U2.37 23.16,24.46 TP19.TP
MA1
  Top 0.254: U5.16 21.22,16.14 20.64,15.56 16.51,15.56 14.92,17.14 14.92,18.1 11.11,21.91 11.11,24.99 10.46,25.64 U2.27
MA2
  Top 0.254: U2.28 11.75,27.08 11.75,22.23 15.54,18.43 15.54,17.48 16.83,16.19 20.32,16.19 20.92,16.79 U5.15
MB1
  Top 0.254: U5.9 21.96,22.8 20,24.77 16.51,24.77 15.56,25.72 15.56,27.08 U2.31
MB2
  Top 0.254: U2.30 14.29,27.08 14.29,26.04 16.19,24.13 19.68,24.13 20.64,23.18 20.64,20.32 20.92,20.04 U5.10
N$1
  Top 0.254: D4.A 24.87,12.7 R4.2
N$2
  Top 0.254: D2.A 13.12,22.86 R1.2
N$3
  Top 0.508: R5.2 1.91,31.75 JP4.2
N$4  (via drill 0.25, 0.5)
  Top 0.254: R10.2 1.91,40.01 v1.27,39.37
  Top 0.508: S2.3 24.74,6.38 23.81,7.3 16.83,7.3 v16.51,7.62 | v12.7,13.34 12.7,13.8 Q1.3
  Bottom 0.254: v1.27,39.37 1.27,16.51 5.08,12.7 5.08,10.79 6.35,9.53 11.43,9.53
  Bottom 0.508: v12.7,13.34 11.43,12.06 11.43,9.53 11.43,8.89 12.7,7.62 v16.51,7.62
N$7  (via drill 0.25)
  Top 0.254: R13.2 v6.35,11.43 | U4.12 v4.76,23.18
  Bottom 0.254: v4.76,23.18 4.76,17.19 6.99,14.97 6.99,12.06 v6.35,11.43
N$8  (via drill 0.25)
  Top 0.254: U4.11 v5.4,23.81 | R14.2 v7.62,11.43
  Bottom 0.254: v5.4,23.81 5.4,17.51 7.62,15.29 v7.62,11.43
N$9
  Top 0.254: U1.1 17.46,6.03 17.78,5.71 17.78,3.81 16.27,2.3 D1.C
N$10
  Top 0.254: Q2.5 18.41,11.43 17.78,10.79 17.14,10.79 16.61,11.33 16.19,11.33 R17.2
N$12
  Top 0.254: Q2.2 18.41,10.16 19.05,10.79 20.74,10.79 R18.2
N$16
  Top 0.254: 20.43,6.03 R6.2
  Top 0.457: U1.5 20.43,6.03
N$17
  Top 0.254: D1.A R3.2
N$26
  Top 0.406: U5.11 20.3,19.39 20,19.68
  Top 0.508: 20,19.68 20,20.64 19.05,21.59 C4.2
OUT1
  Top 0.508: R5.1 1.91,37 Q3.3
OUT1N
  Top 0.254: Q3.1 3.54,35.19 R2.2
RESET  (via drill 0.25)
  Top 0.254: 29.05,51.12 S1.3 29.05,52.66 C2.1 R8.1 | 29.05,51.12 29.05,48.9 | 29.05,48.9 S1.4 | U2.3 21.91,45.11 21.91,47.62 25.4,51.12 29.05,51.12 | Q2.3 19.07,9.51 19.37,9.21 21.59,9.21 22.23,9.84 v22.23,13.34 | v29.84,48.9 29.05,48.9
  Bottom 0.254: v22.23,13.34 22.23,29.21 24.13,31.11 24.13,46.35 26.04,48.26 29.21,48.26 v29.84,48.9
RTS
  Top 0.254: U4.2 13.34,18.73 14.29,17.78 14.29,16.83 16.19,14.92 18.1,14.92 19.05,13.97 19.05,12.28 | 19.05,12.28 19.05,11.73 Q2.4 | R18.1 19.05,12.28
RXD  (via drill 0.25)
  Top 0.254: U4.20 v6.03,18.1 | v19.05,25.72 19.37,26.04 19.37,27.08 U2.34
  Bottom 0.254: v19.05,25.72 8.89,25.72 6.03,22.86 v6.03,18.1
TXD  (via drill 0.25)
  Top 0.254: U2.35 20.62,25.73 v20.64,25.72 | v6.99,21.27 8.26,20 U4.4
  Bottom 0.254: v20.64,25.72 19.68,24.77 8.89,24.77 6.99,22.86 v6.99,21.27
V_BATT
  Top 0.254: 15.02,4.13 C6.1
  Top 0.457: U1.3 15.02,4.13
  Top 0.508: S2.2 27.74,5.55 JP2.2 25.04,8.26 17.46,8.26 17.14,8.57 12.38,8.57 11.11,7.3 11.11,5.08 12.06,4.13 14.82,4.13 C6.1
V_USB
  Top 0.254: C19.1 | C15.1 C14.1 2.44,21.27 U4.15 | 9.79,17 9.79,16.98 R7.2
  Top 0.406: U4.15 4.45,21.27
  Top 0.457: Q1.1 9.79,17 | R7.2 8.89,16.83 4.45,21.27
  Top 0.508: U1.4 C19.1 | F1.2 2.04,11.43 3.81,11.43 4.76,12.38 9.33,12.38 D3.A 10.16,11.55 10.16,9.53 | Q1.1 12.7,15.55 13.65,14.61 13.65,10.16 13.02,9.53 10.16,9.53 | 10.16,9.53 10.16,4.76 11.75,3.17 13.34,3.17 15.56,0.95 20.64,0.95 21.17,1.49 R3.1 21.17,3.7 C19.1
VIN  (via drill 0.5)
  Top 0.406: U5.12 19.68,18.74
  Top 0.508: 19.68,18.74 C4.1 C8.1 15.88,19.68 15.24,20.32 v15.24,21.59 | U3.3 5.39,15.55 5.08,15.24 v5.08,14.61 5.08,13.97 5.39,13.65 U3.1 8.21,13.65 C7.1 9.74,13.71 Q1.2 10.36,13.65 D3.C 12.38,11.63 v12.38,10.79
  Bottom 0.508: v5.08,14.61 2.86,16.83 2.86,28.26 JP4.1 | v12.38,10.79 15.24,10.79 17.78,13.34 17.78,19.05 v15.24,21.59
VINT
  Top 0.254: 19.66,17.44 19.39,17.44 C1.1
  Top 0.406: U5.14 19.66,17.44
VUSB-RAW
  Top 0.457: F1.1 3.09,8.76 C11.1 3.81,6.99 4.45,6.35 5.71,6.35 6.32,5.75 JP15.VBUS

### Text on the board
tNames: I39 | ESP32 WiFi Robot / REV1 | - | LED | + | MB | IO23 | MA | - | +
bNames: Maximilian Kern / 01.01.2019